# Altium schematic sheet DB10005_CellNode.SchDoc
size A4
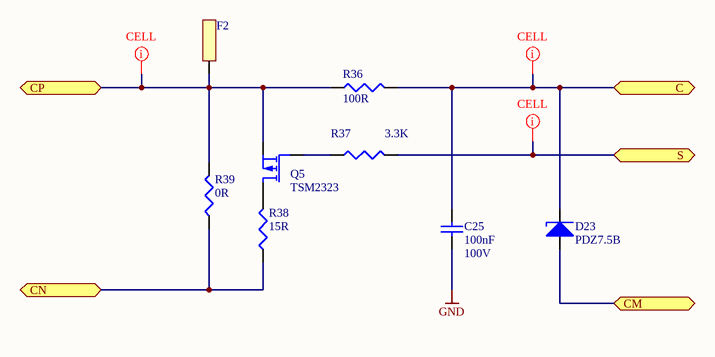
[diagram p0: DB10005_CellNode.SchDoc]

## Parts
C25  100nF  Voltage Rating: 100V  [C-0805]
D23  PDZ7.5B  [SOD-323]
F2  PCB Fuse  [0603_Fuse_0_2MM]  (value not drawn)  (no BOM)
Q5  TSM2323  [SOT-23]
R36  100R  [0603]
R37  3.3K  [0603]
R38  15R  [2512]
R39  0R  [0805]

## Ports
C, CM, CN, CP, S

## Nets
GND: C25.1
C: C25.2 D23.2 R36.2 ; port C
CM: D23.1 ; port CM
CN: R38.1 R39.1 ; port CN
CP: F2.1 Q5.S R36.1 R39.2 ; port CP
S: R37.2 ; port S
NetQ5_D: Q5.D R38.2
NetQ5_G: Q5.G R37.1

## Layout directives
net class CELL: C, CP, S

## Library data of the parts
C25 = 100nF/0805/CER/100V: Capacitor, 100nF, 100V, X7R; Capacitance Tolerance: ± 10%; Capacitor Case Style: 0805; Brand Number: C0805C104K1RACTU; Brand: KEMET; Dielectric Characteristic: X7R; Capacitance: 100nF; Temperature Range: -55°C to +125°C; Price: 0,096; Order Code Supplier: 1650862; Supplier: Farnell
D23 = PDZ7.5B: Diode, Vrrm: 7.5V, If: 0.2A, Vf: 0.9V; Brand: NXP; Brand Number: PDZ7.5B,115; Case Style: SOD-323; Forward Current: 0.2A; Forward Voltage: 0.9V; Order Code Supplier: 2319197; Price: 0,263; Supplier: Farnell; Temperature Range: -65°C to +150°C; Zener Voltage: 7.5V
F2 = PCBFuse_0_2MM: Fuse, PCB, 1A, 60V, T:-40°C +85°C; Price: 0,00; Order Code Supplier: -; Brand: -; Brand Number: -; Supplier: Farnell
Q5 = TSM2323: Mosfet, P-channel, Vds:20V, Id:4.7A, Vgs-th:1V, Rds-on:0.039ohm; Brand: Taiwan Semiconductor; Brand Number: TSM2323CX; Drain Current: 4.7A; Drain Source Voltage: 20V; Gate Source Voltage: 8V; Threshold Voltage: 1V; Case Style: SOT-23; On Resistance: 0.039ohm; Order Code Supplier: 1864590; Price: 0,195; Supplier: Farnell; Temperature Range: -55°C to +150°C; Transistor Polarity: P-channel
R36 = 100/0603/0063W/50V: Resistor, 100R, 1%, 0.063W, 50V, 200PPM, 0603; Brand: VISHAY DRALORIC; Brand Number: CRCW0603100RFKEA; Case Style: 0603; Order Code Supplier: 2122239; Power Rating: 0.063W; Price: 0,007; Resistance: 100R; Supplier: Farnell; Temperature Coefficient: ± 200PPM; Temperature Range: -55°C to +125°C; Voltage Rating: 50V
R37 = 3.3K/0603/0125W/50V: Resistor, 3.3K, 1%, 0.125W, 50V, 100PPM, 0603; Brand: MULTICOMP; Brand Number: MCHP03W8F3301T5E; Case Style: 0603; Order Code Supplier: 1576291; Power Rating: 0.125W; Price: 0,08; Resistance: 3.3K; Supplier: Farnell; Temperature Coefficient: ± 100PPM; Temperature Range: -55°C to +155°C; Voltage Rating: 50V
R38 = 15/2512/2W/250V: Resistor, 15R, 1%, 2W, 200V, 200PPM, 2512; Brand: TE CONNECTIVITY / CGS; Brand Number: 352115RFT; Voltage Rating: 250V; Case Style: 2512; Order Code Supplier: 2117454; Power Rating: 2W; Price: 0,30; Resistance: 15R; Supplier: Farnell; Temperature Coefficient: ± 200PPM; Temperature Range: -55°C to +125°C
R39 = 0/0805/0100W/150V: Resistor, 0R, 0.1%, 0.1W, 150V, 200PPM, 0805; Brand: MULTICOMP; Brand Number: MC 0.1W 0805 0R; Case Style: 0805; Order Code Supplier: 9333681; Power Rating: 0.1W; Price: 0,038; Resistance: 0R; Supplier: Farnell; Temperature Coefficient: ± 200PPM; Temperature Range: -55°C to +125°C; Voltage Rating: 150V